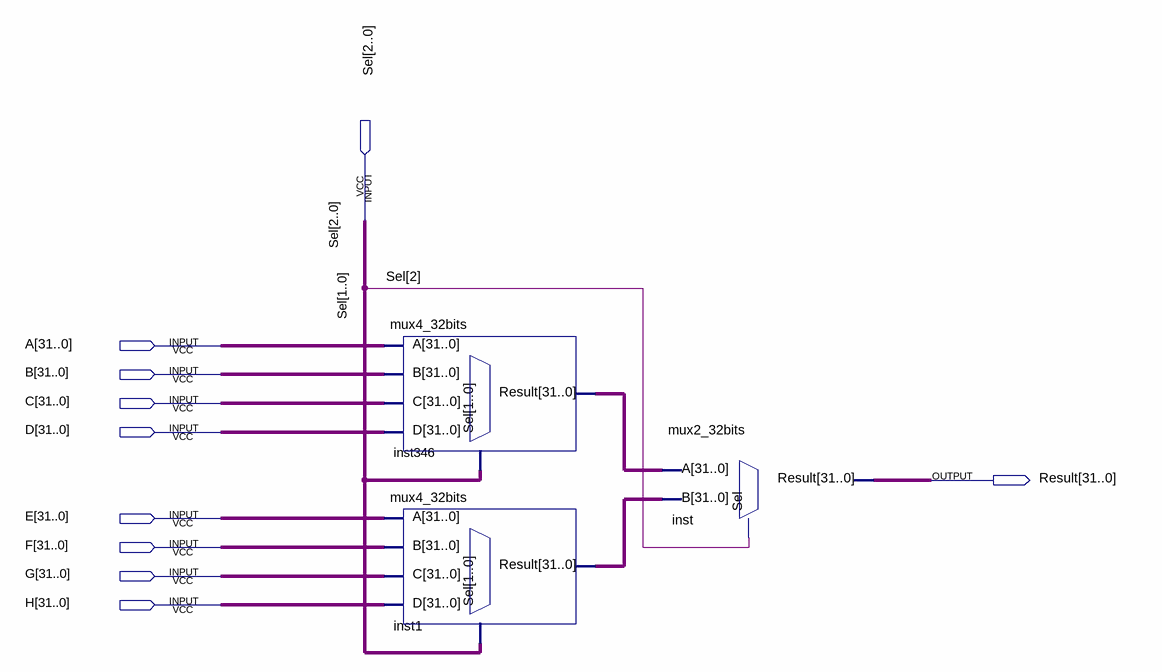
[diagram p0: schematic sheet]
// Quartus schematic mux8_32bits.bdf as structural Verilog: 3 symbols, 10 pins
module mux8_32bits (
  input  [2:0] Sel,
  input  [31:0] A,
  input  [31:0] B,
  input  [31:0] C,
  input  [31:0] D,
  input  [31:0] E,
  input  [31:0] F,
  input  [31:0] G,
  input  [31:0] H,
  output [31:0] Result
);

  wire [31:0] inst1_result, inst346_result;

  mux4_32bits inst346 (.Sel(Sel[1:0]), .A(A), .B(B), .C(C), .D(D), .Result(inst346_result));
  mux4_32bits inst1 (.Sel(Sel[1:0]), .A(E), .B(F), .C(G), .D(H), .Result(inst1_result));
  mux2_32bits inst (.Sel(Sel[2]), .A(inst346_result), .B(inst1_result), .Result(Result));
endmodule
